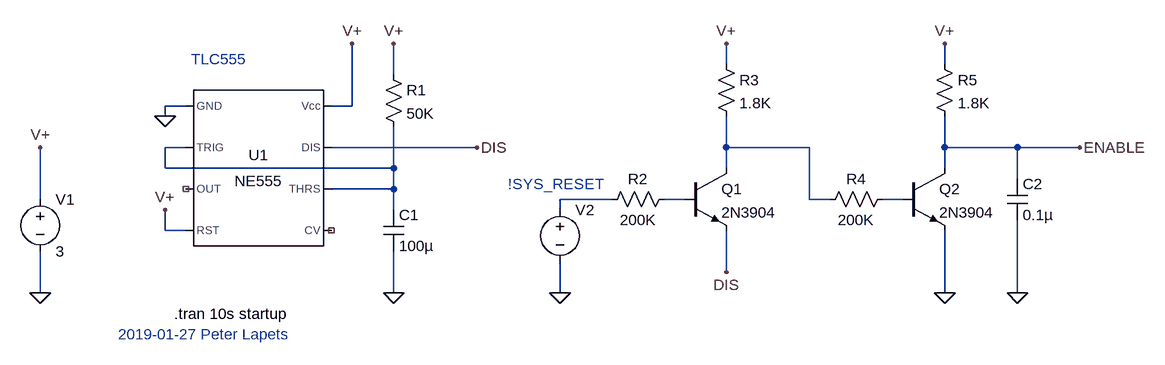
[diagram p0: schematic lockout_v0.asc]
lockout_v0.asc, the LTspice schematic file:
Version 4
SHEET 1 1204 680
WIRE 544 -480 544 -512
WIRE 880 -480 880 -512
WIRE 32 -464 32 -512
WIRE -288 -416 -320 -416
WIRE -32 -416 -32 -512
WIRE -32 -416 -64 -416
WIRE -320 -400 -320 -416
WIRE -288 -352 -320 -352
WIRE 160 -352 -64 -352
WIRE 544 -352 544 -400
WIRE 672 -352 544 -352
WIRE 880 -352 880 -400
WIRE 992 -352 880 -352
WIRE 1088 -352 992 -352
WIRE -320 -320 -320 -352
WIRE 32 -320 32 -384
WIRE 32 -320 -320 -320
WIRE 544 -320 544 -352
WIRE 880 -320 880 -352
WIRE 992 -304 992 -352
WIRE 32 -288 32 -320
WIRE 32 -288 -64 -288
WIRE -512 -272 -512 -352
WIRE 368 -272 288 -272
WIRE 480 -272 448 -272
WIRE 672 -272 672 -352
WIRE 704 -272 672 -272
WIRE 816 -272 784 -272
WIRE 32 -256 32 -288
WIRE 288 -256 288 -272
WIRE -320 -224 -320 -256
WIRE -288 -224 -320 -224
WIRE 544 -160 544 -224
WIRE -512 -128 -512 -192
WIRE 32 -128 32 -192
WIRE 288 -128 288 -176
WIRE 880 -128 880 -224
WIRE 992 -128 992 -240
FLAG -512 -128 0
FLAG -512 -352 V+
FLAG -320 -400 0
FLAG 32 -512 V+
FLAG 32 -128 0
FLAG -32 -512 V+
FLAG 288 -128 0
FLAG 544 -512 V+
FLAG -320 -256 V+
FLAG 544 -160 DIS
FLAG 880 -512 V+
FLAG 160 -352 DIS
FLAG 880 -128 0
FLAG 992 -128 0
FLAG 1088 -352 ENABLE
SYMBOL Misc\\NE555 -176 -320 R0
SYMATTR InstName U1
SYMBOL voltage -512 -288 R0
SYMATTR InstName V1
SYMATTR Value 3
SYMBOL res 16 -480 R0
SYMATTR InstName R1
SYMATTR Value 50K
SYMBOL cap 16 -256 R0
SYMATTR InstName C1
SYMATTR Value 100µ
SYMBOL voltage 288 -272 R0
WINDOW 3 24 96 Invisible 2
WINDOW 123 0 0 Left 2
WINDOW 39 0 0 Left 2
SYMATTR InstName V2
SYMATTR Value PULSE(3 0 1 1m 1m 7)
SYMBOL npn 480 -320 R0
SYMATTR InstName Q1
SYMATTR Value 2N3904
SYMBOL res 464 -288 R90
WINDOW 0 0 56 VBottom 2
WINDOW 3 32 56 VTop 2
SYMATTR InstName R2
SYMATTR Value 200K
SYMBOL res 528 -496 R0
SYMATTR InstName R3
SYMATTR Value 1.8K
SYMBOL npn 816 -320 R0
SYMATTR InstName Q2
SYMATTR Value 2N3904
SYMBOL res 800 -288 R90
WINDOW 0 0 56 VBottom 2
WINDOW 3 32 56 VTop 2
SYMATTR InstName R4
SYMATTR Value 200K
SYMBOL res 864 -496 R0
SYMATTR InstName R5
SYMATTR Value 1.8K
SYMBOL cap 976 -304 R0
SYMATTR InstName C2
SYMATTR Value 0.1µ
TEXT -306 -96 Left 2 !.tran 10s startup
TEXT -392 -64 Left 2 ;2019-01-27 Peter Lapets
TEXT -280 -488 Left 2 ;TLC555
TEXT 208 -296 Left 2 ;!SYS_RESET

The netlist it stands for:
* lockout_v0.asc
XU1 0 N001 NC_01 V+ NC_02 N001 DIS V+ NE555  ; pins GND TRIG OUT RST CV THRS DIS Vcc
V1 V+ 0 3
R1 V+ N001 50K
C1 N001 0 100µ
V2 N003 0 PULSE(3 0 1 1m 1m 7)
Q1 N002 N004 DIS 0 2N3904
R2 N004 N003 200K
R3 V+ N002 1.8K
Q2 ENABLE N005 0 0 2N3904
R4 N005 N002 200K
R5 V+ ENABLE 1.8K
C2 ENABLE 0 0.1µ
.model NPN NPN
.model PNP PNP
.lib standard.bjt
.tran 10s startup
* 2019-01-27 Peter Lapets
* TLC555
* !SYS_RESET
.lib NE555.sub
.backanno
.end